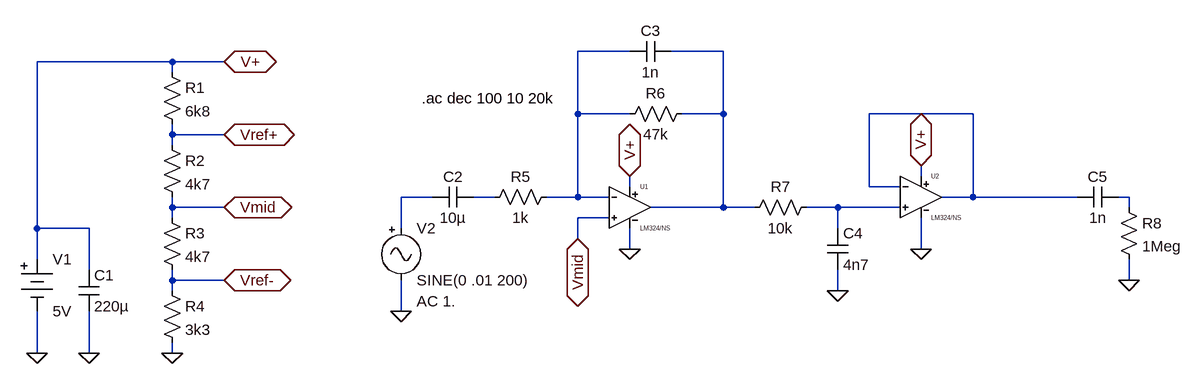
[diagram p0: schematic anti-aliasing.asc]
anti-aliasing.asc, the LTspice schematic file:
Version 4
SHEET 1 1596 680
WIRE 352 0 272 0
WIRE 496 0 416 0
WIRE -352 16 -560 16
WIRE -272 16 -352 16
WIRE -352 32 -352 16
WIRE 272 96 272 0
WIRE 352 96 272 96
WIRE 496 96 496 0
WIRE 496 96 432 96
WIRE 880 96 720 96
WIRE -352 128 -352 112
WIRE -272 128 -352 128
WIRE -352 144 -352 128
WIRE 800 192 800 176
WIRE 352 208 352 192
WIRE 720 208 720 96
WIRE 768 208 720 208
WIRE 48 224 0 224
WIRE 144 224 112 224
WIRE 272 224 272 96
WIRE 272 224 224 224
WIRE 320 224 272 224
WIRE 880 224 880 96
WIRE 880 224 832 224
WIRE 1040 224 880 224
WIRE 1120 224 1104 224
WIRE -352 240 -352 224
WIRE -272 240 -352 240
WIRE 496 240 496 96
WIRE 496 240 384 240
WIRE 544 240 496 240
WIRE 672 240 624 240
WIRE 768 240 672 240
WIRE 1120 240 1120 224
WIRE -352 256 -352 240
WIRE 320 256 272 256
WIRE -560 272 -560 16
WIRE -480 272 -560 272
WIRE 0 272 0 224
WIRE 672 272 672 240
WIRE 272 288 272 256
WIRE 352 304 352 272
WIRE 800 304 800 256
WIRE -560 320 -560 272
WIRE -480 336 -480 272
WIRE -352 352 -352 336
WIRE -272 352 -352 352
WIRE 1120 352 1120 320
WIRE -352 368 -352 352
WIRE 672 368 672 336
WIRE 0 400 0 352
WIRE -560 464 -560 400
WIRE -480 464 -480 400
WIRE -352 464 -352 448
FLAG -352 464 0
FLAG -560 464 0
FLAG -480 464 0
FLAG -272 16 V+
IOPIN -272 16 BiDir
FLAG -272 128 Vref+
IOPIN -272 128 BiDir
FLAG -272 240 Vmid
IOPIN -272 240 BiDir
FLAG -272 352 Vref-
IOPIN -272 352 BiDir
FLAG 352 192 V+
IOPIN 352 192 BiDir
FLAG 352 304 0
FLAG 272 288 Vmid
IOPIN 272 288 BiDir
FLAG 0 400 0
FLAG 672 368 0
FLAG 1120 352 0
FLAG 800 304 0
FLAG 800 176 V+
IOPIN 800 176 BiDir
SYMBOL LM324-national 352 176 R0
SYMATTR InstName U1
SYMBOL Misc\\battery -560 304 R0
WINDOW 123 0 0 Left 2
WINDOW 39 24 128 Left 2
SYMATTR InstName V1
SYMATTR Value 5V
SYMBOL res -368 16 R0
SYMATTR InstName R1
SYMATTR Value 6k8
SYMBOL res -368 128 R0
SYMATTR InstName R2
SYMATTR Value 4k7
SYMBOL res -368 240 R0
SYMATTR InstName R3
SYMATTR Value 4k7
SYMBOL res -368 352 R0
SYMATTR InstName R4
SYMATTR Value 3k3
SYMBOL cap -496 336 R0
SYMATTR InstName C1
SYMATTR Value 220µ
SYMBOL Misc\\signal 0 256 R0
WINDOW 123 24 128 Left 2
WINDOW 39 0 0 Left 2
SYMATTR Value2 AC 1.
SYMATTR InstName V2
SYMATTR Value SINE(0 .01 200)
SYMBOL res 336 112 R270
WINDOW 0 32 56 VTop 2
WINDOW 3 0 56 VBottom 2
SYMATTR InstName R6
SYMATTR Value 47k
SYMBOL res 128 240 R270
WINDOW 0 32 56 VTop 2
WINDOW 3 0 56 VBottom 2
SYMATTR InstName R5
SYMATTR Value 1k
SYMBOL cap 48 240 R270
WINDOW 0 32 32 VTop 2
WINDOW 3 0 32 VBottom 2
SYMATTR InstName C2
SYMATTR Value 10µ
SYMBOL cap 352 16 R270
WINDOW 0 32 32 VTop 2
WINDOW 3 0 32 VBottom 2
SYMATTR InstName C3
SYMATTR Value 1n
SYMBOL res 528 256 R270
WINDOW 0 32 56 VTop 2
WINDOW 3 0 56 VBottom 2
SYMATTR InstName R7
SYMATTR Value 10k
SYMBOL cap 656 272 R0
SYMATTR InstName C4
SYMATTR Value 4n7
SYMBOL res 1104 224 R0
SYMATTR InstName R8
SYMATTR Value 1Meg
SYMBOL LM324-national 800 160 R0
SYMATTR InstName U2
SYMBOL cap 1104 208 R90
WINDOW 0 0 32 VBottom 2
WINDOW 3 32 32 VTop 2
SYMATTR InstName C5
SYMATTR Value 1n
TEXT 32 72 Left 2 !.ac dec 100 10 20k

The netlist it stands for:
* anti-aliasing.asc
XU1 Vmid N001 V+ 0 N002 LM324/NS  ; pins In+ In- V+ V- OUT
V1 V+ 0 5V
R1 V+ Vref+ 6k8
R2 Vref+ Vmid 4k7
R3 Vmid Vref- 4k7
R4 Vref- 0 3k3
C1 V+ 0 220µ
V2 N004 0 SINE(0 .01 200) AC 1.
R6 N001 N002 47k
R5 N005 N001 1k
C2 N004 N005 10µ
C3 N001 N002 1n
R7 N002 N007 10k
C4 N007 0 4n7
R8 N006 0 1Meg
XU2 N007 N003 V+ 0 N003 LM324/NS  ; pins In+ In- V+ V- OUT
C5 N006 N003 1n
.ac dec 100 10 20k
.lib LM324.mod
.backanno
.end